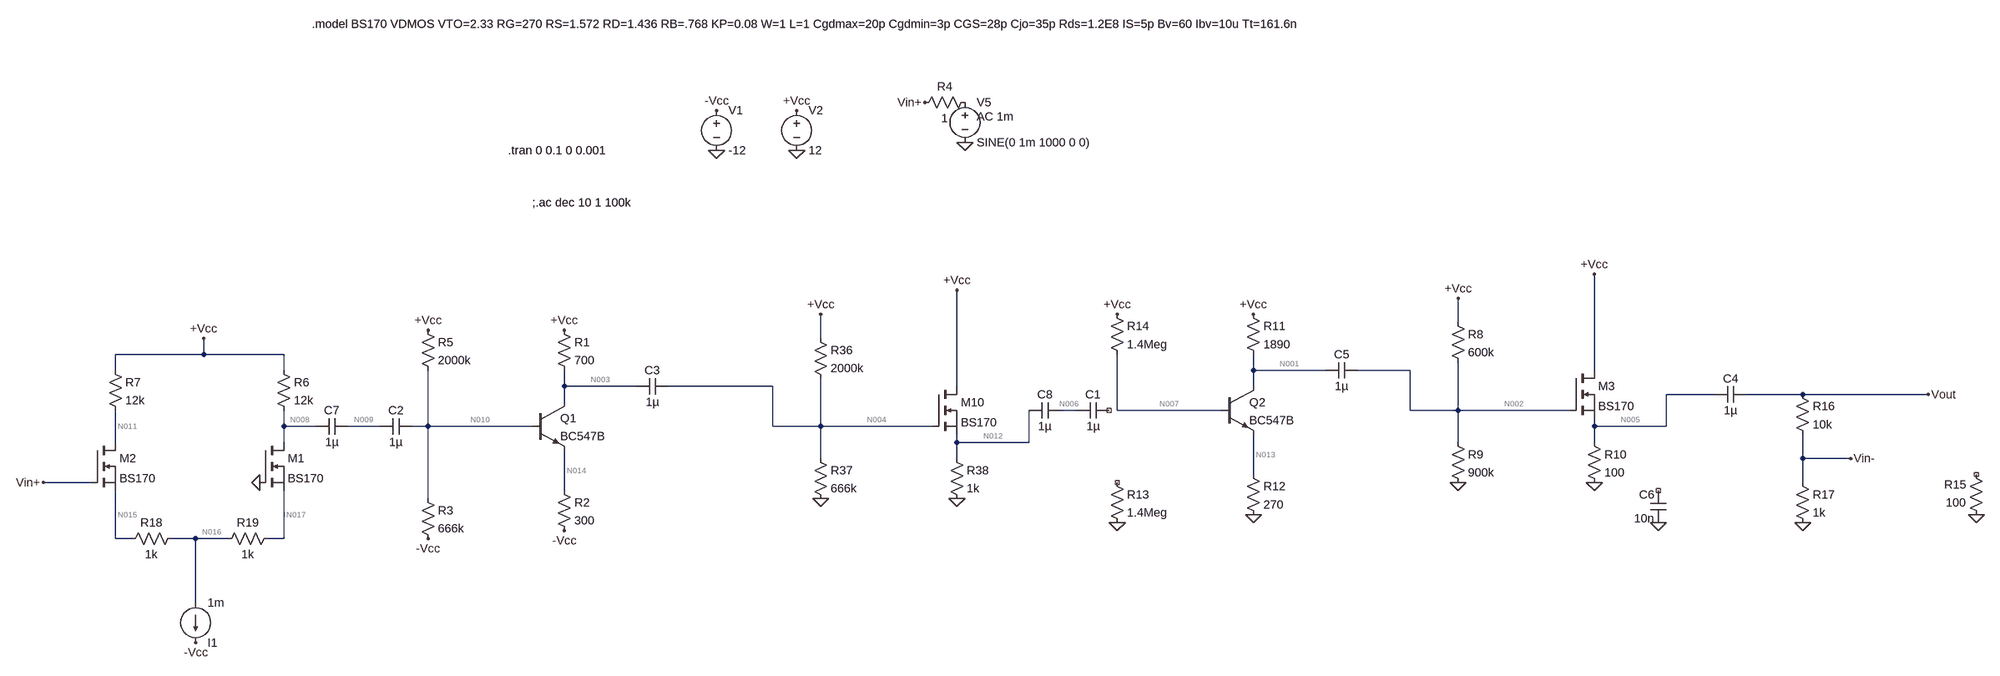
[diagram p0: schematic calculations.asc]
calculations.asc, the LTspice schematic file:
Version 4
SHEET 1 4084 732
WIRE 768 -1392 768 -1440
WIRE -608 -1360 -608 -1408
WIRE -1840 -1328 -1840 -1360
WIRE -1840 -1328 -2016 -1328
WIRE -1680 -1328 -1840 -1328
WIRE -2016 -1296 -2016 -1328
WIRE -1680 -1296 -1680 -1328
WIRE 256 -1296 256 -1328
WIRE 400 -1296 256 -1296
WIRE 672 -1296 464 -1296
WIRE 1040 -1296 1040 -1488
WIRE -1120 -1264 -1120 -1296
WIRE -976 -1264 -1120 -1264
WIRE -704 -1264 -912 -1264
WIRE -336 -1264 -336 -1456
WIRE 256 -1264 256 -1296
WIRE 1280 -1248 1184 -1248
WIRE 1456 -1248 1344 -1248
WIRE 1760 -1248 1456 -1248
WIRE -1120 -1232 -1120 -1264
WIRE -96 -1216 -128 -1216
WIRE -16 -1216 -16 -1328
WIRE 192 -1216 -16 -1216
WIRE 672 -1216 672 -1296
WIRE 768 -1216 768 -1312
WIRE 768 -1216 672 -1216
WIRE 992 -1216 768 -1216
WIRE -1680 -1184 -1680 -1216
WIRE -1616 -1184 -1680 -1184
WIRE -1488 -1184 -1552 -1184
WIRE -1392 -1184 -1392 -1296
WIRE -1392 -1184 -1424 -1184
WIRE -1184 -1184 -1392 -1184
WIRE -704 -1184 -704 -1264
WIRE -608 -1184 -608 -1280
WIRE -608 -1184 -704 -1184
WIRE -384 -1184 -608 -1184
WIRE 1040 -1184 1040 -1200
WIRE 1184 -1184 1184 -1248
WIRE 1184 -1184 1040 -1184
WIRE -2016 -1152 -2016 -1216
WIRE -1680 -1152 -1680 -1184
WIRE -336 -1152 -336 -1168
WIRE -192 -1152 -192 -1216
WIRE -192 -1152 -336 -1152
WIRE 768 -1152 768 -1216
WIRE 1040 -1152 1040 -1184
WIRE -608 -1120 -608 -1184
WIRE -336 -1120 -336 -1152
WIRE 1456 -1120 1456 -1168
WIRE 1552 -1120 1456 -1120
WIRE 256 -1088 256 -1168
WIRE -2064 -1072 -2160 -1072
WIRE 1456 -1072 1456 -1120
WIRE -1120 -1056 -1120 -1136
WIRE -1392 -1040 -1392 -1184
WIRE -2016 -960 -2016 -1056
WIRE -1984 -960 -2016 -960
WIRE -1856 -960 -1904 -960
WIRE -1792 -960 -1856 -960
WIRE -1680 -960 -1680 -1056
WIRE -1680 -960 -1712 -960
WIRE -1856 -832 -1856 -960
FLAG -816 -1760 0
FLAG -656 -1760 0
FLAG -816 -1840 -Vcc
FLAG -656 -1840 +Vcc
FLAG -320 -1776 0
FLAG -400 -1856 Vin+
FLAG -608 -1408 +Vcc
FLAG -336 -1456 +Vcc
FLAG -1392 -1376 +Vcc
FLAG -1120 -1376 +Vcc
FLAG -336 -1040 0
FLAG -608 -1040 0
FLAG -1840 -1360 +Vcc
FLAG 768 -1440 +Vcc
FLAG 1040 -1488 +Vcc
FLAG 256 -1008 0
FLAG -16 -992 0
FLAG -16 -1408 +Vcc
FLAG 256 -1408 +Vcc
FLAG 1040 -1072 0
FLAG 768 -1072 0
FLAG 1856 -1008 0
FLAG 1168 -992 0
FLAG 1456 -992 0
FLAG -2160 -1072 Vin+
FLAG 1552 -1120 Vin-
FLAG 1760 -1248 Vout
FLAG -1728 -1072 0
FLAG -1856 -752 -Vcc
FLAG -1392 -960 -Vcc
FLAG -1120 -976 -Vcc
SYMBOL voltage -816 -1856 R0
WINDOW 123 0 0 Left 0
WINDOW 39 0 0 Left 0
SYMATTR InstName V1
SYMATTR Value -12
SYMBOL voltage -656 -1856 R0
WINDOW 123 0 0 Left 0
WINDOW 39 0 0 Left 0
SYMATTR InstName V2
SYMATTR Value 12
SYMBOL voltage -320 -1872 R0
WINDOW 123 24 44 Left 2
WINDOW 39 0 0 Left 0
SYMATTR Value2 AC 1m
SYMATTR InstName V5
SYMATTR Value SINE(0 1m 1000 0 0)
SYMBOL res -304 -1872 R90
WINDOW 0 0 56 VBottom 2
WINDOW 3 32 56 VTop 2
SYMATTR InstName R4
SYMATTR Value 1
SYMBOL nmos -384 -1264 R0
SYMATTR InstName M10
SYMATTR Value BS170
SYMBOL res -624 -1376 R0
SYMATTR InstName R36
SYMATTR Value 2000k
SYMBOL res -624 -1136 R0
SYMATTR InstName R37
SYMATTR Value 666k
SYMBOL res -352 -1136 R0
SYMATTR InstName R38
SYMATTR Value 1k
SYMBOL npn -1184 -1232 R0
SYMATTR InstName Q1
SYMATTR Value BC547B
SYMBOL res -1136 -1392 R0
SYMATTR InstName R1
SYMATTR Value 700
SYMBOL res -1136 -1072 R0
SYMATTR InstName R2
SYMATTR Value 300
SYMBOL res -1408 -1056 R0
SYMATTR InstName R3
SYMATTR Value 666k
SYMBOL res -1408 -1392 R0
SYMATTR InstName R5
SYMATTR Value 2000k
SYMBOL cap -32 -1232 R90
WINDOW 0 0 32 VBottom 2
WINDOW 3 32 32 VTop 2
SYMATTR InstName C1
SYMATTR Value 1µ
SYMBOL cap -912 -1280 R90
WINDOW 0 0 32 VBottom 2
WINDOW 3 32 32 VTop 2
SYMATTR InstName C3
SYMATTR Value 1µ
SYMBOL nmos -2064 -1152 R0
SYMATTR InstName M2
SYMATTR Value BS170
SYMBOL res -1696 -1312 R0
SYMATTR InstName R6
SYMATTR Value 12k
SYMBOL res -2032 -1312 R0
SYMATTR InstName R7
SYMATTR Value 12k
SYMBOL current -1856 -832 R0
WINDOW 0 24 80 Left 2
WINDOW 3 24 0 Left 2
WINDOW 123 0 0 Left 0
WINDOW 39 0 0 Left 0
SYMATTR InstName I1
SYMATTR Value 1m
SYMBOL nmos -1728 -1152 R0
SYMATTR InstName M1
SYMATTR Value BS170
SYMBOL nmos 992 -1296 R0
SYMATTR InstName M3
SYMATTR Value BS170
SYMBOL res 752 -1408 R0
SYMATTR InstName R8
SYMATTR Value 600k
SYMBOL res 752 -1168 R0
SYMATTR InstName R9
SYMATTR Value 900k
SYMBOL res 1024 -1168 R0
SYMATTR InstName R10
SYMATTR Value 100
SYMBOL npn 192 -1264 R0
SYMATTR InstName Q2
SYMATTR Value BC547B
SYMBOL res 240 -1424 R0
SYMATTR InstName R11
SYMATTR Value 1890
SYMBOL res 240 -1104 R0
SYMATTR InstName R12
SYMATTR Value 270
SYMBOL res -32 -1088 R0
SYMATTR InstName R13
SYMATTR Value 1.4Meg
SYMBOL res -32 -1424 R0
SYMATTR InstName R14
SYMATTR Value 1.4Meg
SYMBOL cap 1344 -1264 R90
WINDOW 0 0 32 VBottom 2
WINDOW 3 32 32 VTop 2
SYMATTR InstName C4
SYMATTR Value 1µ
SYMBOL cap 464 -1312 R90
WINDOW 0 0 32 VBottom 2
WINDOW 3 32 32 VTop 2
SYMATTR InstName C5
SYMATTR Value 1µ
SYMBOL res 1872 -992 R180
WINDOW 0 36 76 Left 2
WINDOW 3 36 40 Left 2
SYMATTR InstName R15
SYMATTR Value 100
SYMBOL cap 1184 -992 R180
WINDOW 0 24 56 Left 2
WINDOW 3 24 8 Left 2
SYMATTR InstName C6
SYMATTR Value 10n
SYMBOL res 1440 -1264 R0
SYMATTR InstName R16
SYMATTR Value 10k
SYMBOL res 1440 -1088 R0
SYMATTR InstName R17
SYMATTR Value 1k
SYMBOL res -1888 -976 R90
WINDOW 0 0 56 VBottom 2
WINDOW 3 32 56 VTop 2
SYMATTR InstName R18
SYMATTR Value 1k
SYMBOL res -1696 -976 R90
WINDOW 0 0 56 VBottom 2
WINDOW 3 32 56 VTop 2
SYMATTR InstName R19
SYMATTR Value 1k
SYMBOL cap -1424 -1200 R90
WINDOW 0 0 32 VBottom 2
WINDOW 3 32 32 VTop 2
SYMATTR InstName C2
SYMATTR Value 1µ
SYMBOL cap -1552 -1200 R90
WINDOW 0 0 32 VBottom 2
WINDOW 3 32 32 VTop 2
SYMATTR InstName C7
SYMATTR Value 1µ
SYMBOL cap -128 -1232 R90
WINDOW 0 0 32 VBottom 2
WINDOW 3 32 32 VTop 2
SYMATTR InstName C8
SYMATTR Value 1µ
TEXT -1232 -1760 Left 2 !.tran 0 0.1 0 0.001
TEXT -1624 -2048 Left 2 !.model BS170 VDMOS VTO=2.33 RG=270 RS=1.572 RD=1.436 RB=.768 KP=0.08 W=1 L=1 Cgdmax=20p Cgdmin=3p CGS=28p Cjo=35p Rds=1.2E8 IS=5p Bv=60 Ibv=10u Tt=161.6n
TEXT -1184 -1656 Left 2 !;.ac dec 10 1 100k

The netlist it stands for:
* calculations.asc
V1 -Vcc 0 -12
V2 +Vcc 0 12
V5 P001 0 SINE(0 1m 1000 0 0) AC 1m
R4 P001 Vin+ 1
M10 +Vcc N004 N012 N012 BS170
R36 +Vcc N004 2000k
R37 N004 0 666k
R38 N012 0 1k
Q1 N003 N010 N014 0 BC547B
R1 +Vcc N003 700
R2 N014 -Vcc 300
R3 N010 -Vcc 666k
R5 +Vcc N010 2000k
C1 NC_01 N006 1µ
C3 N004 N003 1µ
M2 N011 Vin+ N015 N015 BS170
R6 +Vcc N008 12k
R7 +Vcc N011 12k
I1 N016 -Vcc 1m
M1 N008 0 N017 N017 BS170
M3 +Vcc N002 N005 N005 BS170
R8 +Vcc N002 600k
R9 N002 0 900k
R10 N005 0 100
Q2 N001 N007 N013 0 BC547B
R11 +Vcc N001 1890
R12 N013 0 270
R13 NC_02 0 1.4Meg
R14 +Vcc N007 1.4Meg
C4 Vout N005 1µ
C5 N002 N001 1µ
R15 0 NC_03 100
C6 0 NC_04 10n
R16 Vout Vin- 10k
R17 Vin- 0 1k
R18 N016 N015 1k
R19 N017 N016 1k
C2 N010 N009 1µ
C7 N009 N008 1µ
C8 N006 N012 1µ
.model NPN NPN
.model PNP PNP
.lib standard.bjt
.model NMOS NMOS
.model PMOS PMOS
.lib standard.mos
.tran 0 0.1 0 0.001
.model BS170 VDMOS VTO=2.33 RG=270 RS=1.572 RD=1.436 RB=.768 KP=0.08 W=1 L=1 Cgdmax=20p Cgdmin=3p CGS=28p Cjo=35p Rds=1.2E8 IS=5p Bv=60 Ibv=10u Tt=161.6n
;.ac dec 10 1 100k
.backanno
.end

* Results of the author's LTspice run, read from the files saved beside the schematic
* Operating Point, zero values left out:
*   V(-vcc) = -12 V
*   V(+vcc) = 12 V
*   V(n004) = 2.998 V
*   V(n012) = 549.7 mV
*   V(n003) = 9.735 V
*   V(n010) = -10.36 V
*   V(n014) = -11.03 V
*   V(n006) = 549.7 nV
*   V(n011) = 6 V
*   V(n015) = -2.443 V
*   V(n008) = 6 V
*   V(n016) = -2.943 V
*   V(n017) = -2.443 V
*   V(n002) = 7.2 V
*   V(n005) = 3.831 V
*   V(n001) = 7.541 V
*   V(n007) = 1.299 V
*   V(n013) = 639.1 mV
*   V(n009) = -4.363 µV
*   Ic(Q2) = 2.359 mA
*   Ib(Q2) = 7.644 µA
*   Ie(Q2) = -2.367 mA
*   Ic(Q1) = 3.236 mA
*   Ib(Q1) = 8.723 µA
*   Ie(Q1) = -3.245 mA
*   Id(M3) = 38.31 mA
*   Is(M3) = -38.31 mA
*   Id(M1) = 500 µA
*   Is(M1) = -500 µA
*   Id(M2) = 500 µA
*   Is(M2) = -500 µA
*   Id(M10) = 549.7 µA
*   Is(M10) = -549.7 µA
*   I(I1) = 1 mA
*   I(R19) = 500 µA
*   I(R18) = -500 µA
*   I(R14) = 7.644 µA
*   I(R12) = 2.367 mA
*   I(R11) = 2.359 mA
*   I(R10) = 38.31 mA
*   I(R9) = 8 µA
*   I(R8) = 8 µA
*   I(R7) = 500 µA
*   I(R6) = 500 µA
*   I(R5) = 11.18 µA
*   I(R3) = 2.458 µA
*   I(R2) = 3.245 mA
*   I(R1) = 3.236 mA
*   I(R38) = 549.7 µA
*   I(R37) = 4.501 µA
*   I(R36) = 4.501 µA
*   I(V2) = -45.49 mA
*   I(V1) = 4.247 mA
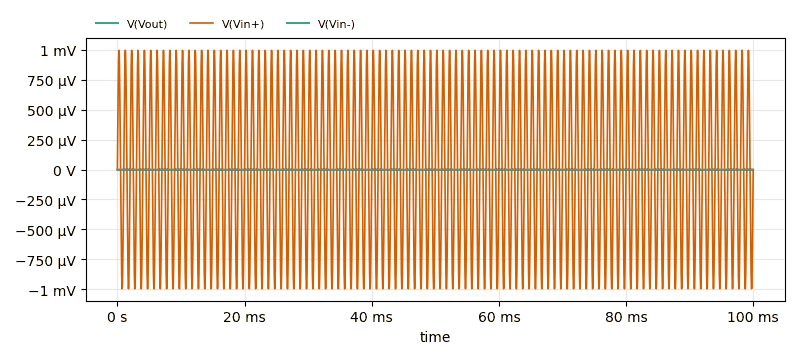
[diagram p1: Transient Analysis of calculations.asc, plotted from the saved traces]
* Transient Analysis, 1 run:
*   V(Vout): min -208.2 pV, max 114.9 pV, average -5.012 pV, rms 44.26 pV, last 34.09 pV
*   V(Vin+): min -996.8 µV, max 996.8 µV, average 4.943 nV, rms 705.8 µV, last -166.6 pV
*   V(Vin-): min -18.93 pV, max 10.44 pV, average -455.6 fV, rms 4.023 pV, last 3.099 pV